# EAGLE design fuel injectorREVB (EAGLE 6.5.0)
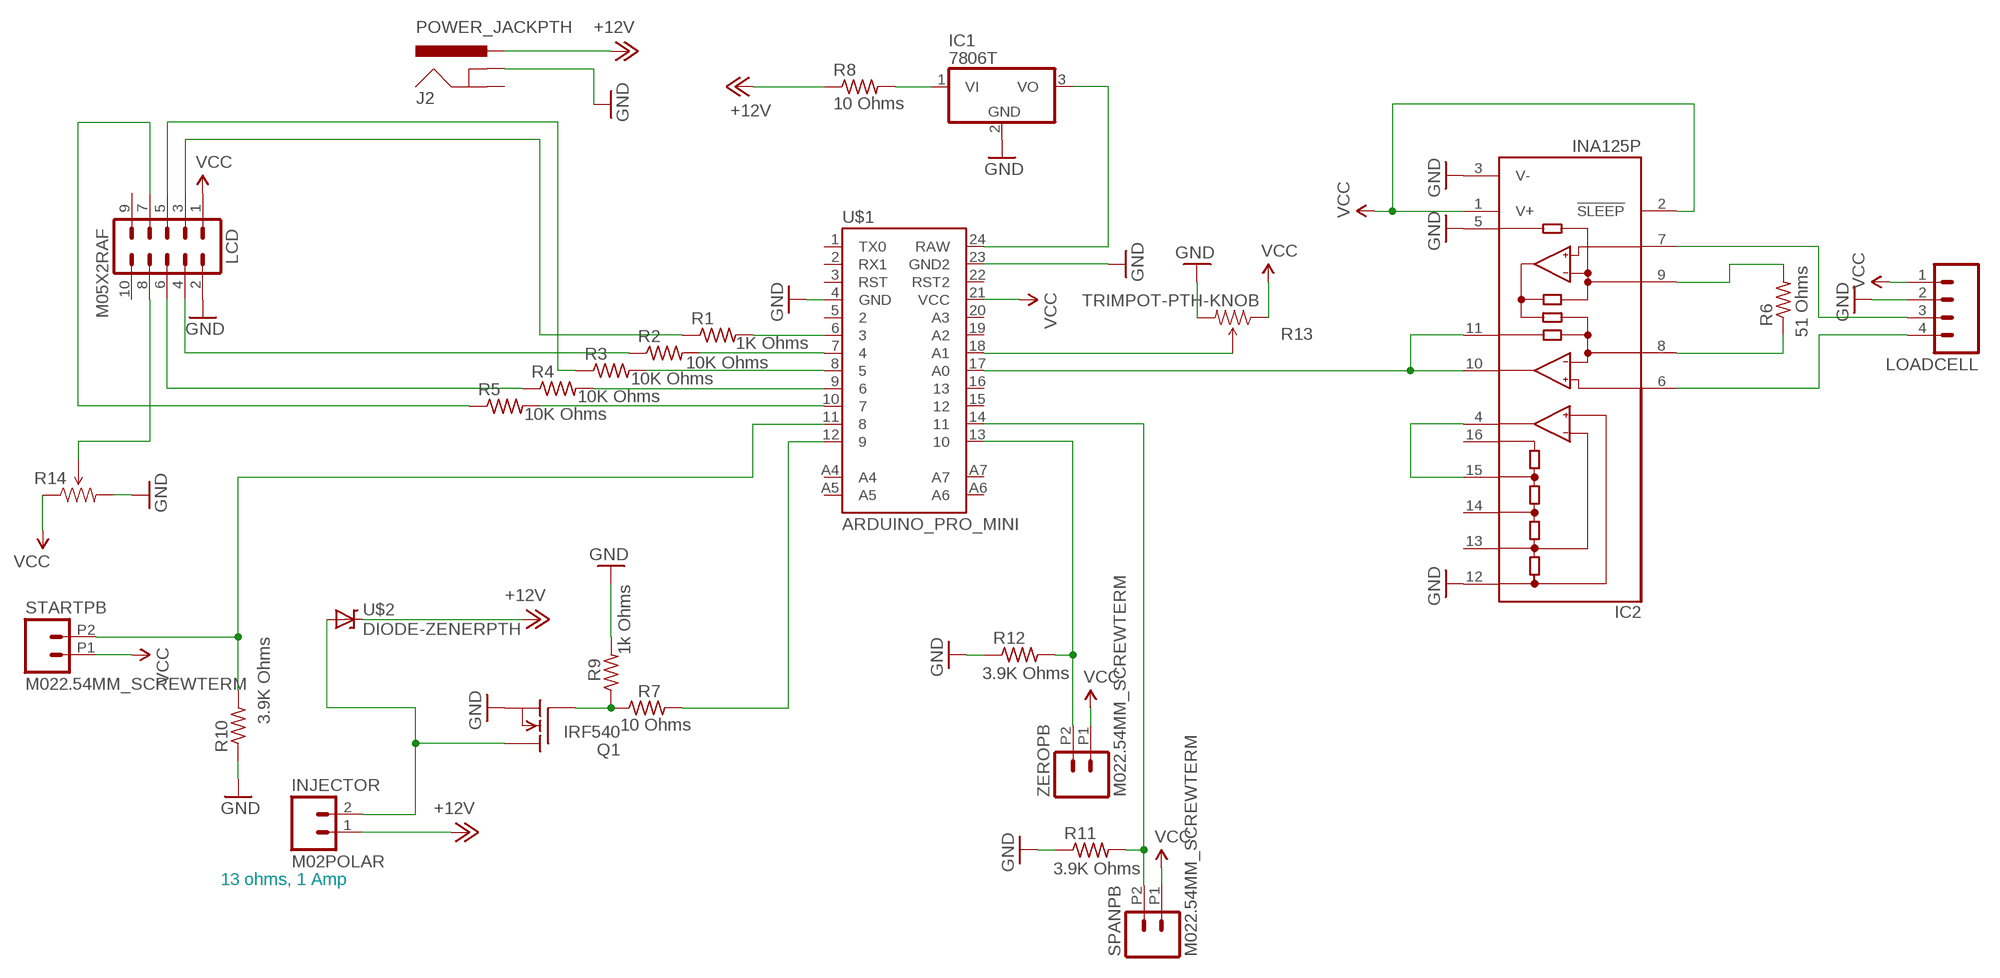
[diagram p0: schematic, sheet 1]

## Parts
IC1  7806T  [TO220H]
IC2  INA125P  [DIL16]
INJECTOR  M02POLAR  [MOLEX-1X2]
J2  POWER_JACKPTH  [POWER_JACK_PTH]
LCD  M05X2RAF  [2X5-RAF]
LOADCELL  M04POLAR  [MOLEX-1X4]
Q1  IRF540  [TO220]
R1  1K Ohms  R-US_0309/10  [0309/10]
R2  10K Ohms  R-US_0309/10  [0309/10]
R3  10K Ohms  R-US_0309/10  [0309/10]
R4  10K Ohms  R-US_0309/10  [0309/10]
R5  10K Ohms  R-US_0309/10  [0309/10]
R6  51 Ohms  R-US_0309/10  [0309/10]
R7  10 Ohms  R-US_0207/15  [0207/15]
R8  10 Ohms  R-US_0613/15  [P0613/15]
R9  1k Ohms  R-US_0309/10  [0309/10]
R10  3.9K Ohms  R-US_0309/10  [0309/10]
R11  3.9K Ohms  R-US_0309/10  [0309/10]
R12  3.9K Ohms  R-US_0309/10  [0309/10]
R13  TRIMPOT-PTH-KNOB  [3386U]
R14  TRIMPOT-PTH-KNOB  [3386U]
SPANPB  M022.54MM_SCREWTERM  [1X02_2.54_SCREWTERM]
STARTPB  M022.54MM_SCREWTERM  [1X02_2.54_SCREWTERM]
U$1  ARDUINO_PRO_MINI  [ARDUINO_PRO_MINI]
U$2  DIODE-ZENERPTH  [DIODE-ZENER]
ZEROPB  M022.54MM_SCREWTERM  [1X02_2.54_SCREWTERM]

## Nets
+12V: INJECTOR.1 J2.PWR R8.1 U$2.P$1(C)
GND: IC1.2(GND) IC2.3(V-) IC2.5(REF) IC2.12(REFCOM) J2.GNDBREAK LCD.2 LOADCELL.2 Q1.3(S) R9.2 R10.1 R11.1 R12.1 R13.3(CW) R14.3(CW) U$1.4(GND) U$1.23(GND2)
N$1: R7.2 U$1.12
N$2: IC1.1(VI) R8.2
N$3: IC1.3(VO) U$1.24(RAW)
N$4: Q1.1(G) R7.1 R9.1
N$5: R1.2 U$1.6
N$6: INJECTOR.2 Q1.2(D) U$2.P$2(A)
N$7: R2.2 U$1.7
N$8: R3.2 U$1.8
N$9: R4.2 U$1.9
N$10: R5.2 U$1.10
N$11: R12.2 U$1.13 ZEROPB.P2
N$12: LCD.3 R1.1
N$13: LCD.4 R2.1
N$14: LCD.5 R3.1
N$15: LCD.6 R4.1
N$16: LCD.7 R5.1
N$17: LCD.8 R14.2(WIPER)
N$18: R10.2 STARTPB.P2 U$1.11
N$19: R11.2 SPANPB.P2 U$1.14
N$20: R13.2(WIPER) U$1.18(A1)
N$21: IC2.4(REFOUT) IC2.15(REF5)
N$22: IC2.10(OUT) IC2.11(SENSE) U$1.17(A0)
N$24: IC2.8(RG) R6.1
N$25: IC2.9(RG) R6.2
N$26: IC2.6(+IN) LOADCELL.4
N$27: IC2.7(-IN) LOADCELL.3
VCC: IC2.1(V+) IC2.2(!SLEEP) LCD.1 LOADCELL.1 R13.1(CCW) R14.1(CCW) SPANPB.P1 STARTPB.P1 U$1.21(VCC) ZEROPB.P1
Unconnected: IC2.13(REFBG) IC2.14(REF2.5) IC2.16(REF10) J2.GND LCD.9 LCD.10 U$1.1(TX0) U$1.2(RX1) U$1.3(RST) U$1.5 U$1.15 U$1.16 U$1.19(A2) U$1.20(A3) U$1.22(RST2) U$1.A4 U$1.A5 U$1.A6 U$1.A7

## Notes on the sheet
- 13 ohms, 1 Amp

## Library data of the parts
IC1 = linear:78*: Positive VOLTAGE REGULATOR Source: http://cache.national.com/ds/LM/LM78L05.pdf http://www.fairchildsemi.com/ds/LM/LM7805.pdf; OC_NEWARK: unknown
IC2 = burr-brown:INA125: Instrumentation Amplifier with Precision Voltage Reference; MF: TEXAS INSTRUMENT CONNECTORS; MPN: INA125P; OC_FARNELL: 1459461; OC_NEWARK: 35C1726
INJECTOR SPANPB STARTPB ZEROPB = SparkFun-Connectors:M02: Standard 2-pin 0.1" header. Use with - straight break away headers ( PRT-00116) - right angle break away headers (PRT-00553) - swiss pins (PRT-00743) - machine pins (PRT-00117) - female headers (PRT-00115) Molex polarized connector foot print use with: PRT-08233 with associated crimp pins and housings. 2.54_SCREWTERM for use with PRT-10571. 3.5mm Screw Terminal footprints for PRT-08084 5mm Screw Terminal footprints for use with PRT-08433
J2 = SparkFun-Connectors:POWER_JACK: Power Jack This is the standard 5.5mm barrel jack for power. The PTH is the most common, proven, reliable, footprint. The Slot footprint only works if the mill layer is transmitted to the PCB fab house so be warned. Spark Fun Electronics SKU : PRT-00119 SMT: CONN-08106 Mating wall wart : TOL-00298 (and others)
LCD = SparkFun-Connectors:M05X2: Header 5x2 Standard 10-pin dual row 0.1" header. Commonly used with AVR-ISP. Use with Spark Fun Electronics SKU: PRT-00778
LOADCELL = SparkFun-Connectors:M04: Header 4 Standard 4-pin 0.1" header. Use with straight break away headers (SKU : PRT-00116), right angle break away headers (PRT-00553), swiss pins (PRT-00743), machine pins (PRT-00117), and female headers (PRT-00115). Molex polarized connector foot print use with SKU : PRT-08231 with associated crimp pins and housings. 1MM SMD Version SKU: PRT-10208
Q1 = transistor-fet:IRF540: N-Channel Enhancement MOSFET (HEXFET); 100V; 28A; 0,077Ohm; OC_NEWARK: unknown
R1-R7 R9-R12 = resistor:R-US_: RESISTOR, American symbol
R8 = rcl:R-US_: RESISTOR, American symbol
R13 R14 = SparkFun-Electromechanical:TRIMPOT: Various small potentiometers for "set-and-forget" applications
U$1 = SparkFun-Boards:ARDUINO_PRO_MINI; OC_NEWARK: unknown
U$2 = SparkFun-DiscreteSemi:DIODE-ZENER: Zener Diode Production Part - 8199 3.4V Zener Voltage; OC_NEWARK: unknown

## Net classes
0 default: width 0.305 mm, drill 0.508 mm, clearance 0.254 mm

## Board
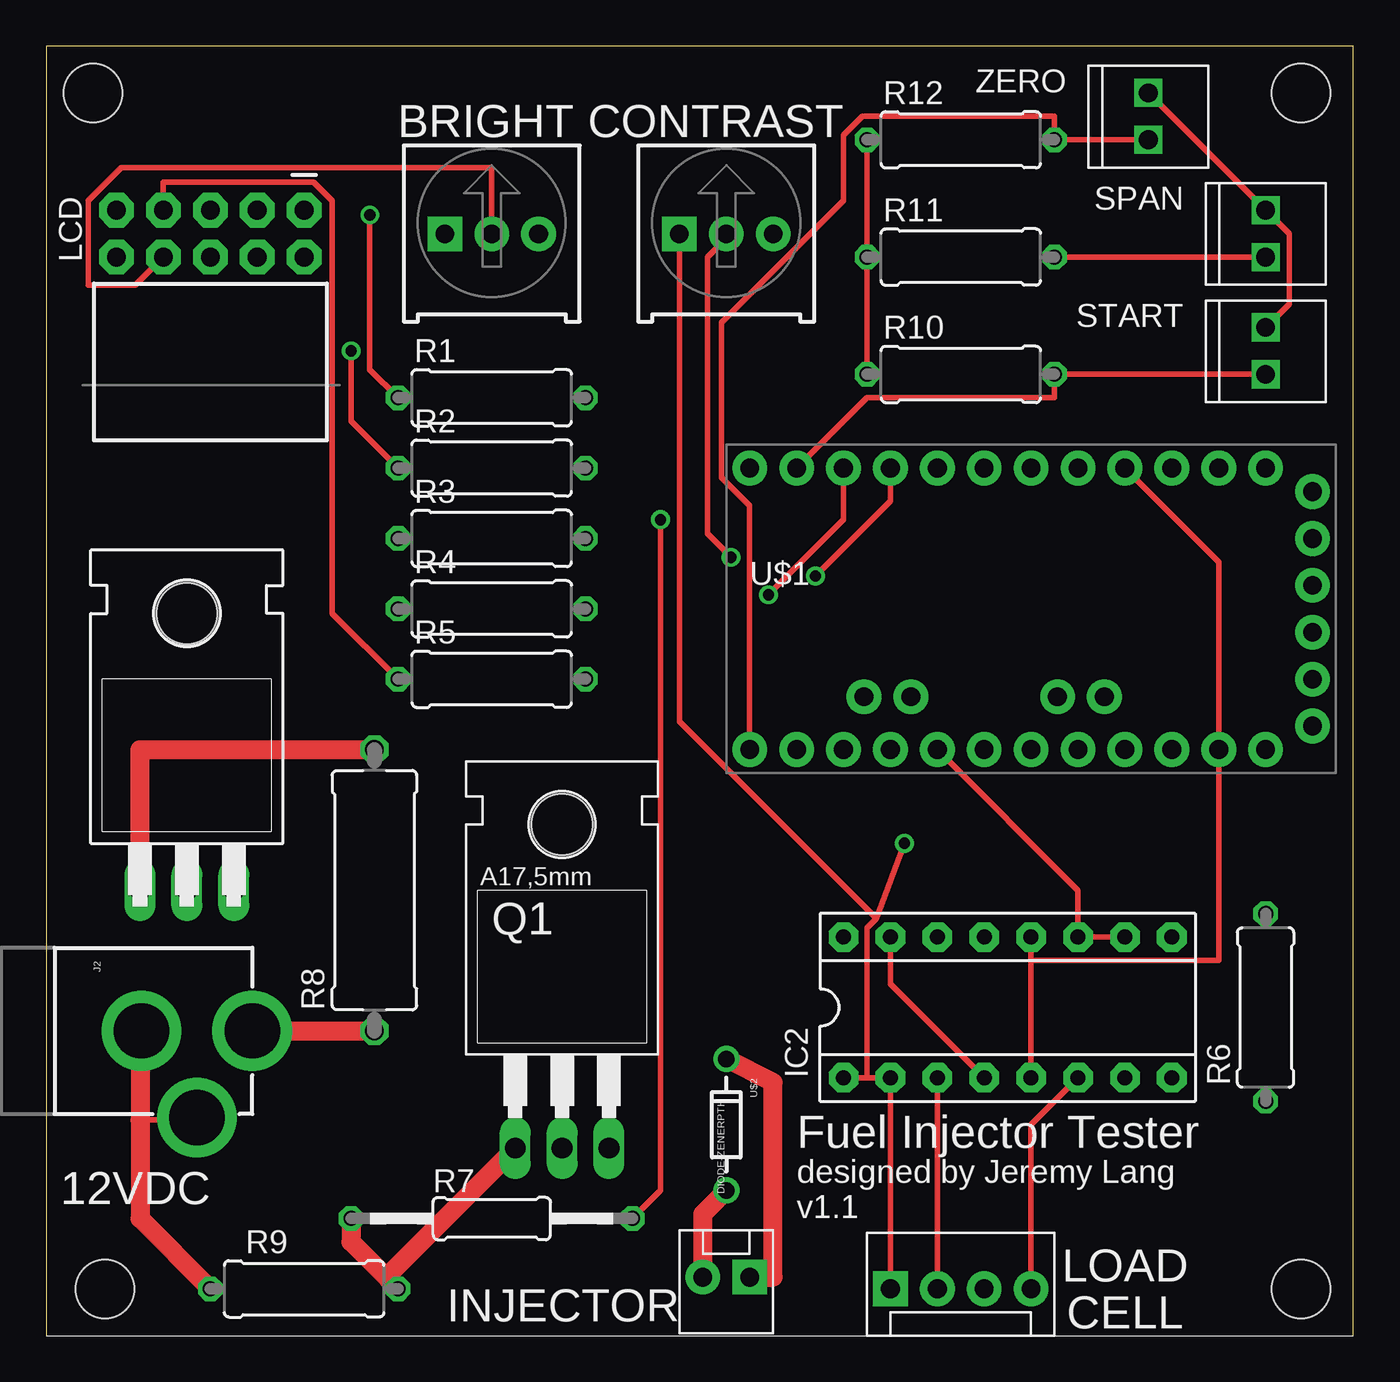
[diagram p1: board, top side]
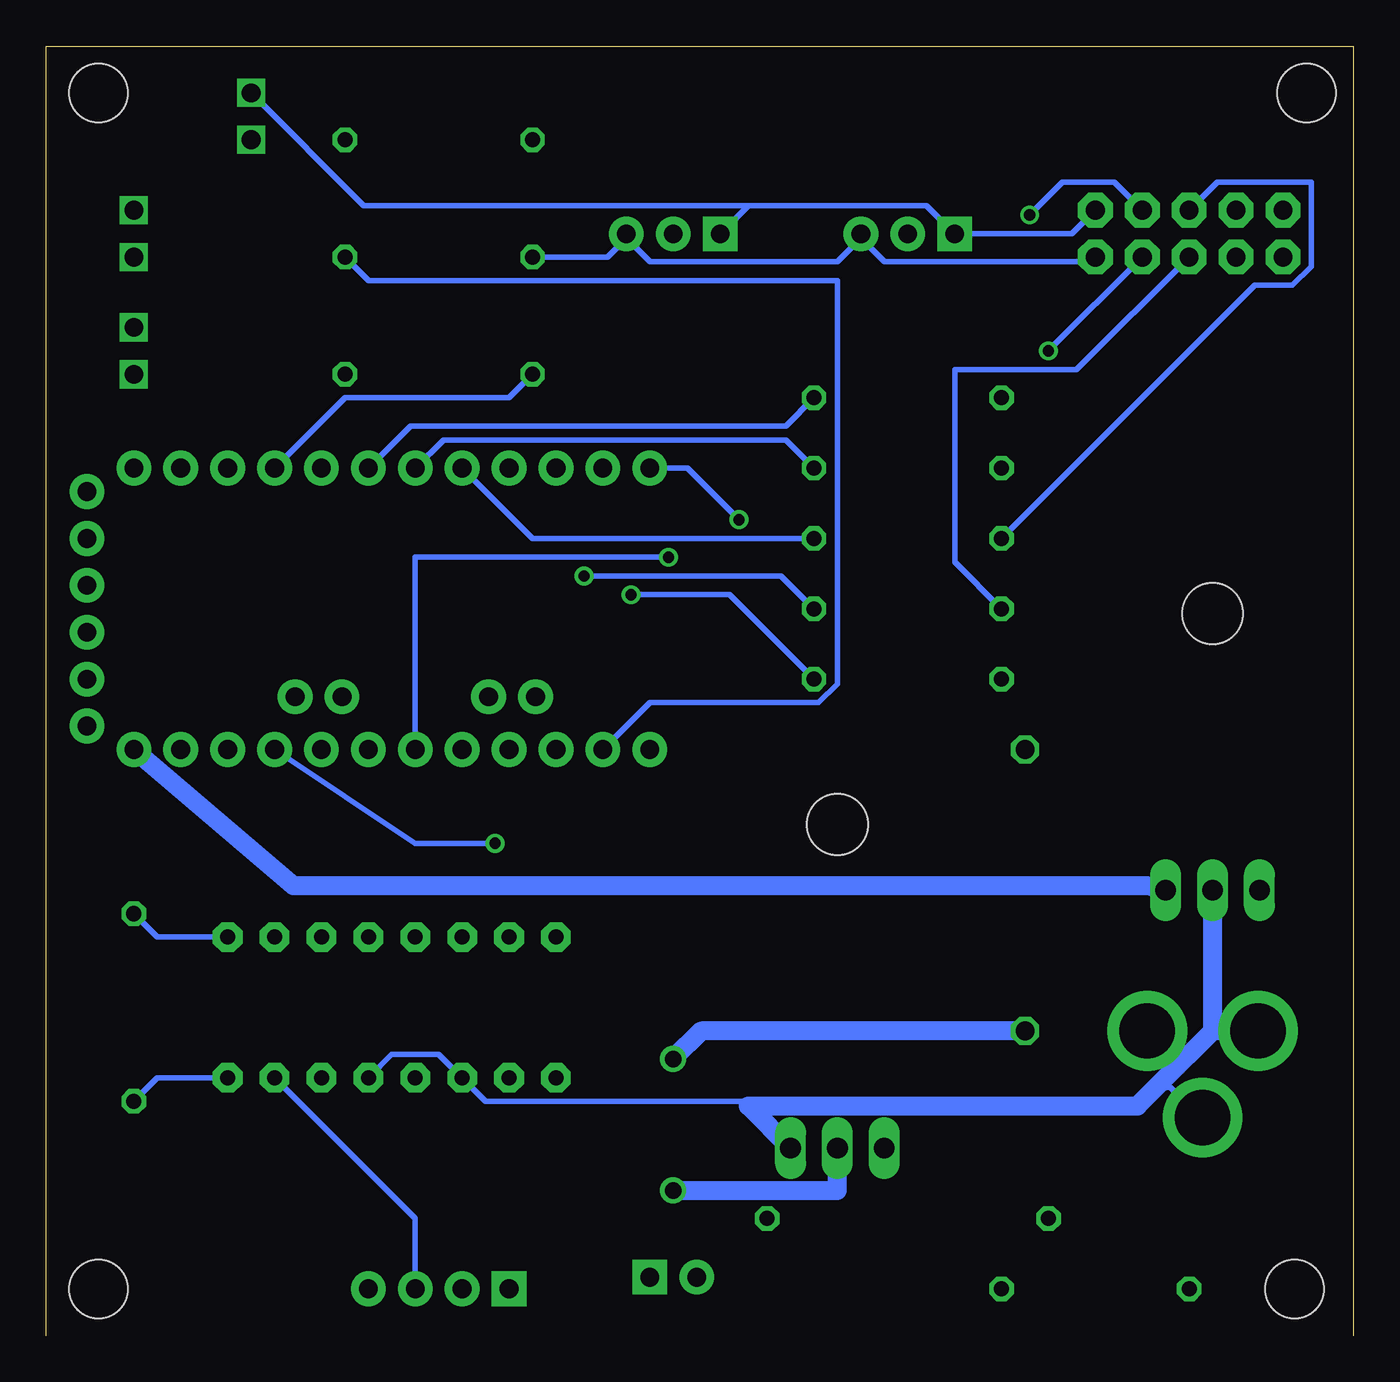
[diagram p2: board, bottom side, seen from below]

Size 70.79 x 69.84 mm. Coordinates in mm from the lower left corner, seen from the top.
Outline: 70.79,0 70.79,69.84 0,69.84 0,0
Copper layers (1*16): Top 0.035mm / dielectric 1.5mm / Bottom 0.035mm
Design rules "default": minimum track width 10mil, minimum drill 24mil, track to track 8mil, track to pad 8mil, pad to pad 8mil, via to via 8mil, smd to smd 8mil, copper to edge 40mil, drill to drill 8mil, minimum pad ring 10mil, minimum via ring 8mil, stop-mask expansion 4mil, vias tented up to drill 0mil, thermal gap 10mil
Holes 3.17 mm at 67.94,67.31 67.94,2.54 3.17,2.54 2.54,67.31

### Footprints (pad centres in the part's own frame; a part is rotated, then mirrored left to right if it is on the bottom)
TO220H = drill 1.118 long: 1 -2.54,-10.16; 2 0,-10.16; 3 2.54,-10.16 | hole 3.302: 0,4.826
DIL16 = drill 0.813 pad 1.6 octagon: 1 -8.89,-3.81; 2 -6.35,-3.81; 3 -3.81,-3.81; 4 -1.27,-3.81; 5 1.27,-3.81; 6 3.81,-3.81; 7 6.35,-3.81; 8 8.89,-3.81; 9 8.89,3.81; 10 6.35,3.81; 11 3.81,3.81; 12 1.27,3.81; 13 -1.27,3.81; 14 -3.81,3.81; 15 -6.35,3.81; 16 -8.89,3.81
MOLEX-1X2 = drill 1.016 pad 1.88 square: 1 0,0 | drill 1.016 pad 1.88: 2 2.54,0
POWER_JACK_PTH = drill 2.997 pad 4.318: GND 0,7.7; GNDBREAK 4.7,10.7; PWR 0,13.7
2X5-RAF = drill 1.016 pad 1.88 octagon: 1 -1.27,5.08; 2 1.27,5.08; 3 -1.27,2.54; 4 1.27,2.54; 5 -1.27,0; 6 1.27,0; 7 -1.27,-2.54; 8 1.27,-2.54; 9 -1.27,-5.08; 10 1.27,-5.08
MOLEX-1X4 = drill 1.016 pad 1.88 square: 1 0,0 | drill 1.016 pad 1.88: 2 2.54,0; 3 5.08,0; 4 7.62,0
TO220 = drill 1.118 long: 1 -2.54,-6.35; 2 0,-6.35; 3 2.54,-6.35 | hole 3.302: 0,11.176
0309/10 = drill 0.813 octagon: 1 -5.08,0; 2 5.08,0
0207/15 = drill 0.813 octagon: 1 -7.62,0; 2 7.62,0
P0613/15 = drill 1.016 octagon: 1 -7.62,0; 2 7.62,0
3386U = drill 1.016 pad 1.88 square: 1 -2.54,-0.015 | drill 1.016 pad 1.88: 2 0,-0.015; 3 2.54,-0.015
1X02_2.54_SCREWTERM = drill 1.016 square: P1 2.54,0; P2 0,0
ARDUINO_PRO_MINI = drill 1.016 pad 1.88: 1 -7.62,12.7; 2 -7.62,10.16; 3 -7.62,7.62; 4 -7.62,5.08; 5 -7.62,2.54; 6 -7.62,0; 7 -7.62,-2.54; 8 -7.62,-5.08; 9 -7.62,-7.62; 10 -7.62,-10.16; 11 -7.62,-12.7; 12 -7.62,-15.24; 13 7.62,-15.24; 14 7.62,-12.7; 15 7.62,-10.16; 16 7.62,-7.62; 17 7.62,-5.08; 18 7.62,-2.54; 19 7.62,0; 20 7.62,2.54; 21 7.62,5.08; 22 7.62,7.62; 23 7.62,10.16; 24 7.62,12.7; A4 4.763,1.429; A5 4.763,3.969; A6 4.763,-9.049; A7 4.763,-6.509; BLK -6.35,15.24; GND -3.81,15.24; GRN 6.35,15.24; RXI 1.27,15.24; TXO 3.81,15.24; VCC -1.27,15.24
DIODE-ZENER = drill 0.9: P$1 -3.556,0; P$2 3.556,0

### Placement (x,y rotation side)
IC1  7.62,34.29 0 top
IC2  52.07,17.78 0 top
INJECTOR  38.1,3.17 180 top
J2  -2.54,16.51 270 top
LCD  8.89,59.69 270 top
LOADCELL  45.72,2.54 0 top
Q1  27.94,16.51 0 top
R1  24.13,50.8 0 top
R2  24.13,46.99 0 top
R3  24.13,43.18 0 top
R4  24.13,39.37 0 top
R5  24.13,35.56 0 top
R6  66.04,17.78 90 top
R7  24.13,6.35 0 top
R8  17.78,24.13 90 top
R9  13.97,2.54 180 top
R10  49.53,52.07 0 top
R11  49.53,58.42 0 top
R12  49.53,64.77 0 top
R13  36.83,59.69 0 top
R14  24.13,59.69 0 top
SPANPB  66.04,58.42 90 top
STARTPB  66.04,52.07 90 top
U$1  53.34,39.37 270 top
U$2  36.83,11.43 270 top
ZEROPB  59.69,64.77 90 top

### Tracks (layer width: path | path; a pad name or v marks a point on that pad's centre or on a via)
+12V
  Top 1.016: U$2.P$1 39.37,13.72 39.37,3.17 INJECTOR.1 | J2.PWR R8.1
  Bottom 1.016: U$2.P$1 35.31,16.51 R8.1
GND
  Top 0.305: IC2.5 53.34,20.32 | 53.34,20.32 IC2.12 | IC2.3 LOADCELL.2 | U$1.4 63.5,41.91 U$1.23 63.5,20.32 53.34,20.32 | R10.1 R11.1 R12.1 | 5.08,11.68 8.13,11.68 J2.GNDBREAK
  Top 1.016: R9.2 5.08,6.35 5.08,11.68 5.08,16.26
  Bottom 0.305: IC2.5 52.07,15.24 49.53,15.24 IC2.3 46.99,12.7 33.02,12.7 32.77,12.45 | LCD.2 14.22,58.17 25.4,58.17 26.67,59.44 | 39.37,59.44 40.39,58.42 R11.1 | 26.67,59.44 27.94,58.17 38.1,58.17 39.37,59.44 | 26.67,59.44 R14.3 | 39.37,59.44 R13.3 | U$1.4 54.61,50.8 45.72,50.8 R10.1 | J2.GNDBREAK 8.38,11.94 9.91,13.46 10.16,13.46 10.41,13.72
  Bottom 1.016: 7.62,16.51 IC1.2 | 5.08,16.51 7.62,16.51 | Q1.3 32.77,12.45 11.68,12.45 10.41,13.72 7.62,16.51
N$1  (via drill 0.61)
  Top 0.305: R7.2 33.27,7.87 v33.27,44.2
  Bottom 0.305: v33.27,44.2 36.07,46.99 U$1.12
N$2
  Top 1.016: IC1.1 5.08,31.75 R8.2
N$3
  Bottom 1.016: IC1.3 11.18,24.38 57.4,24.38 U$1.24
N$4
  Top 0.305: 18.54,3.05 18.54,3.3
  Top 1.016: R9.1 18.54,3.05 16.51,5.08 R7.1 | 18.54,3.3 Q1.1
N$5
  Bottom 0.305: R1.2 30.73,49.28 51.05,49.28 U$1.6
N$6
  Top 1.016: U$2.P$2 35.56,6.6 INJECTOR.2
  Bottom 1.016: Q1.2 27.94,7.87 U$2.P$2
N$7
  Bottom 0.305: R2.2 30.73,48.51 49.28,48.51 U$1.7
N$8
  Bottom 0.305: R3.2 44.45,43.18 U$1.8
N$9  (via drill 0.61)
  Top 0.305: v41.66,41.15 45.72,45.21 U$1.9
  Bottom 0.305: R4.2 30.99,41.15 v41.66,41.15
N$10  (via drill 0.61)
  Top 0.305: v39.12,40.13 43.18,44.2 U$1.10
  Bottom 0.305: R5.2 33.78,40.13 v39.12,40.13
N$11
  Top 0.305: ZEROPB.P2 R12.2 54.61,66.04 44.2,66.04 43.18,65.02 43.18,61.47 36.58,54.86 36.58,46.48 38.1,44.96 U$1.13
N$12  (via drill 0.61)
  Top 0.305: R1.1 17.53,52.32 v17.53,60.71
  Bottom 0.305: v17.53,60.71 15.75,62.48 12.95,62.48 LCD.3
N$13  (via drill 0.61)
  Top 0.305: R2.1 16.51,49.53 v16.51,53.34
  Bottom 0.305: LCD.4 v16.51,53.34
N$14
  Bottom 0.305: R3.1 5.33,56.9 3.3,56.9 2.29,57.91 2.29,62.48 7.37,62.48 LCD.5
N$15
  Bottom 0.305: R4.1 21.59,41.91 21.59,52.32 14.99,52.32 LCD.6
N$16
  Top 0.305: R5.1 15.49,39.12 15.49,61.47 14.48,62.48 6.35,62.48 LCD.7
N$17
  Top 0.305: LCD.8 4.83,56.9 2.29,56.9 2.29,61.47 4.06,63.25 24.13,63.25 R14.2
N$18
  Top 0.305: STARTPB.P2 R10.2 54.61,50.8 44.45,50.8 U$1.11
N$19
  Top 0.305: SPANPB.P2 R11.2
  Bottom 0.305: U$1.14 38.1,34.29 28.96,34.29 27.94,35.31 27.94,57.15 53.34,57.15 R11.2
N$20  (via drill 0.61)
  Top 0.305: v37.08,42.16 35.81,43.43 35.81,58.42 36.83,59.44 R13.2
  Bottom 0.305: U$1.18 50.8,42.16 v37.08,42.16
N$21
  Top 0.305: IC2.4 45.72,19.05 IC2.15
N$22
  Top 0.305: IC2.10 IC2.11 55.88,24.13 U$1.17
N$24
  Bottom 0.305: R6.1 64.77,13.97 IC2.8
N$25
  Bottom 0.305: R6.2 64.77,21.59 IC2.9
N$26
  Top 0.305: IC2.6 53.34,11.43 LOADCELL.4
N$27
  Bottom 0.305: IC2.7 50.8,6.35 LOADCELL.3
VCC  (via drill 0.61)
  Top 0.305: 44.45,13.97 IC2.2 LOADCELL.1 | 44.45,13.97 IC2.1 | 44.96,22.61 44.45,22.1 44.45,13.97 | 44.96,22.61 v46.48,26.67 | STARTPB.P1 67.31,55.88 67.31,59.69 SPANPB.P1 ZEROPB.P1 | 44.96,22.61 34.29,33.27 R13.1
  Bottom 0.305: U$1.21 50.8,26.67 v46.48,26.67 | 21.59,59.69 15.24,59.69 LCD.1 | 32.77,61.21 34.29,59.69 R13.1 | 32.77,61.21 23.11,61.21 21.59,59.69 | 21.59,59.69 R14.1 | ZEROPB.P1 53.59,61.21 32.77,61.21

### Text on the board
tNames: ZERO | BRIGHT | CONTRAST | SPAN | START | Fuel Injector Tester | 12VDC | designed by Jeremy Lang | v1.1 | LOAD | INJECTOR | CELL